# EAGLE design coffre2019 (EAGLE 8.5.2)
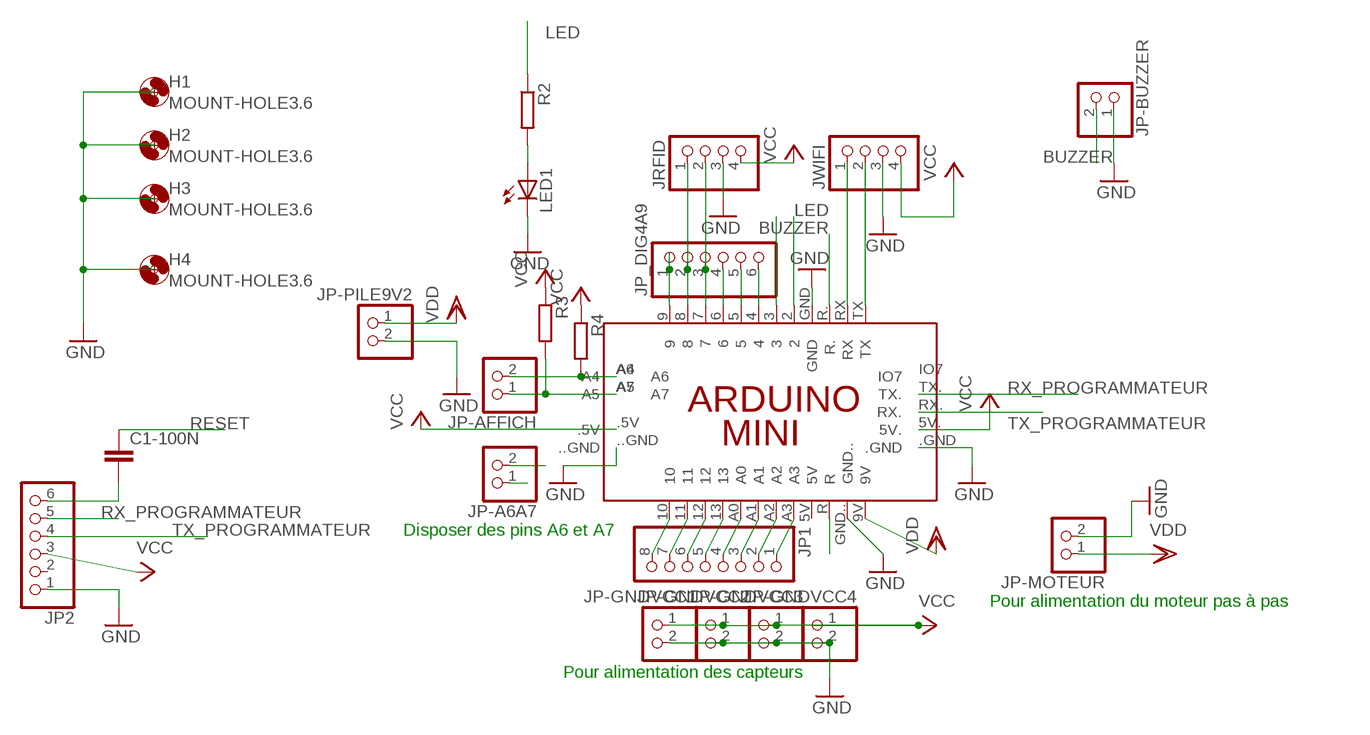
[diagram p0: schematic, sheet 1]

## Parts
C1-100N  C5/3  [C5B3]
H1  MOUNT-HOLE3.6  [3,6]
H2  MOUNT-HOLE3.6  [3,6]
H3  MOUNT-HOLE3.6  [3,6]
H4  MOUNT-HOLE3.6  [3,6]
JP1  PINHD-1X8  [1X08]
JP2  PINHD-1X6  [1X06]
JP-A6A7  PINHD-1X2  [1X02]
JP-AFFICH  PINHD-1X2  [1X02]
JP-BUZZER  PINHD-1X2  [1X02]
JP-GNDVCC1  PINHD-1X2  [1X02]
JP-GNDVCC2  PINHD-1X2  [1X02]
JP-GNDVCC3  PINHD-1X2  [1X02]
JP-GNDVCC4  PINHD-1X2  [1X02]
JP-MOTEUR  PINHD-1X2  [1X02]
JP-PILE9V2  PINHD-1X2  [1X02]
JP_DIG4A9  PINHD-1X6  [1X06]
JRFID  PINHD-1X4  [1X04]
JWIFI  PINHD-1X4  [1X04]
LED1  LED5MM  [LED5MM]
PCB1  ARDUINO_MINI  [ARDUINO_MINI]
R2  R-EU_0207/10  [0207/10]
R3  R-EU_0207/10  [0207/10]
R4  R-EU_0207/10  [0207/10]

## Nets
BUZZER: JP-BUZZER.2 PCB1.3
GND: JP2.1 JP-BUZZER.1 JP-GNDVCC1.2 JP-GNDVCC2.2 JP-GNDVCC3.2 JP-GNDVCC4.2 JP-MOTEUR.2 JP-PILE9V2.2 JRFID.3 JWIFI.3 LED1.K(C) PCB1...GND PCB1..GND PCB1.GND PCB1.GND..
LED: PCB1.2 R2.1
N$1: JP-MOTEUR.1
N$2: JP_DIG4A9.2 JRFID.1 PCB1.8
N$4: JWIFI.1 PCB1.RX
N$5: JP_DIG4A9.3 JRFID.2 PCB1.7
N$6: JWIFI.2 PCB1.TX
N$7: LED1.A R2.2
N$8: JP1.8 PCB1.10
N$9: JP1.7 PCB1.11
N$10: JP1.6 PCB1.12
N$11: JP1.5 PCB1.13
N$12: JP1.4 PCB1.A0
N$13: JP1.3 PCB1.A1
N$14: JP1.2 PCB1.A2
N$15: JP1.1 PCB1.A3
N$16: C1-100N.2 JP2.6
N$18: JP_DIG4A9.6 PCB1.4
N$19: JP_DIG4A9.5 PCB1.5
N$20: JP_DIG4A9.4 PCB1.6
N$21: JP-AFFICH.2 PCB1.A4 R4.2
N$22: JP-AFFICH.1 PCB1.A5 R3.2
N$23: PCB1.R
PIN9ARD: JP_DIG4A9.1 PCB1.9
RESET: C1-100N.1 PCB1.R.
RX_PROGRAMMATEUR: JP2.5 PCB1.TX.
TX_PROGRAMMATEUR: JP2.4 PCB1.RX.
VCC: JP2.3 JP-GNDVCC1.1 JP-GNDVCC2.1 JP-GNDVCC3.1 JP-GNDVCC4.1 JRFID.4 JWIFI.4 PCB1.5V. PCB1..5V R3.1 R4.1
VDD: JP-PILE9V2.1 PCB1.9V
VERSA6: JP-A6A7.2
VERSA7: JP-A6A7.1
Unconnected: JP2.2 PCB1.5V PCB1.A6 PCB1.A7 PCB1.IO7

## Notes on the sheet
- Disposer des pins A6 et A7
- Pour alimentation du moteur pas à pas
- Pour alimentation des capteurs

## Library data of the parts
C1-100N = capacitor-wima:C: CAPACITOR naming: grid - package width
H1-H4 = holes:MOUNT-HOLE: MOUNTING HOLE with drill center marker
JP1 = pinhead:PINHD-1X8: PIN HEADER
JP2 JP_DIG4A9 = pinhead:PINHD-1X6: PIN HEADER
JP-A6A7 JP-AFFICH JP-BUZZER JP-GNDVCC1-JP-GNDVCC4 JP-MOTEUR JP-PILE9V2 = pinhead:PINHD-1X2: PIN HEADER
JRFID JWIFI = pinhead:PINHD-1X4: PIN HEADER
LED1 = led:LED: LED OSRAM: - CHIPLED LG R971, LG N971, LY N971, LG Q971, LY Q971, LO R971, LY R971 LH N974, LH R974 LS Q976, LO Q976, LY Q976 LO Q996 - Hyper CHIPLED LW Q18S LB Q993, LB Q99A, LB R99A - SideLED LS A670, LO A670, LY A670, LG A670, LP A670 LB A673, LV A673, LT A673, LW A673 LH A674 LY A675 LS A676, LA A676, LO A676, LY A676, LW A676 LS A679, LY A679, LG A679 - Hyper Micro SIDELED® LS Y876, LA Y876, LO Y876, LY Y876 LT Y87S - SmartLED LW L88C, LW L88S LB L89C, LB L89S, LG L890 LS L89K, LO L89K, LY L89K LS L896, LA L896, LO L896, LY L896 - TOPLED LS T670, LO T670, LY T670, LG T670, LP T670 LSG T670, LSP T670, LSY T670, LOP T670, LYG T670 LG T671, LOG T671, LSG T671 LB T673, LV T673, LT T673, LW T673 LH T674 LS T676, LA T676, LO T676, LY T676, LB T676, LH T676, LSB T676, LW T676 LB T67C, LV T67C, LT T67C, LS T67K, LO T67K, LY T67K, LW E67C LS E67B, LA E67B, LO E67B, LY E67B, LB E67C, LV E67C, LT E67C LW T67C LS T679, LY T679, LG T679 LS T770, LO T770, LY T770, LG T770, LP T770 LB T773, LV T773, LT T773, LW T773 LH T774 LS E675, LA E675, LY E675, LS T675 LS T776, LA T776, LO T776, LY T776, LB T776 LHGB T686 LT T68C, LB T68C - Hyper Mini TOPLED® LB M676 - Mini TOPLED Santana® LG M470 LS M47K, LO M47K, LY M47K Source: http://www.osram.convergy.de LUXEON: - LUMILED® LXK2-PW12-R00, LXK2-PW12-S00, LXK2-PW14-U00, LXK2-PW14-V00 LXK2-PM12-R00, LXK2-PM12-S00, LXK2-PM14-U00 LXK2-PE12-Q00, LXK2-PE12-R00, LXK2-PE12-S00, LXK2-PE14-T00, LXK2-PE14-U00 LXK2-PB12-K00, LXK2-PB12-L00, LXK2-PB12-M00, LXK2-PB14-N00, LXK2-PB14-P00, LXK2-PB14-Q00 LXK2-PR12-L00, LXK2-PR12-M00, LXK2-PR14-Q00, LXK2-PR14-R00 LXK2-PD12-Q00, LXK2-PD12-R00, LXK2-PD12-S00 LXK2-PH12-R00, LXK2-PH12-S00 LXK2-PL12-P00, LXK2-PL12-Q00, LXK2-PL12-R00 Source: www.luxeon.com KINGBRIGHT: KA-3528ASYC Source: www.kingbright.com
PCB1 = E14_Arduino_revC:ARDUINO_MINI: Device for representing an Arduino Mini board with a footprint in an EAGLE design. Created by Dave Young for Element14. More EAGLE documentation at: http://www.element14.com/community/community/knode/cadsoft_eagle
R2-R4 = resistor:R-EU_: RESISTOR, European symbol

## Board
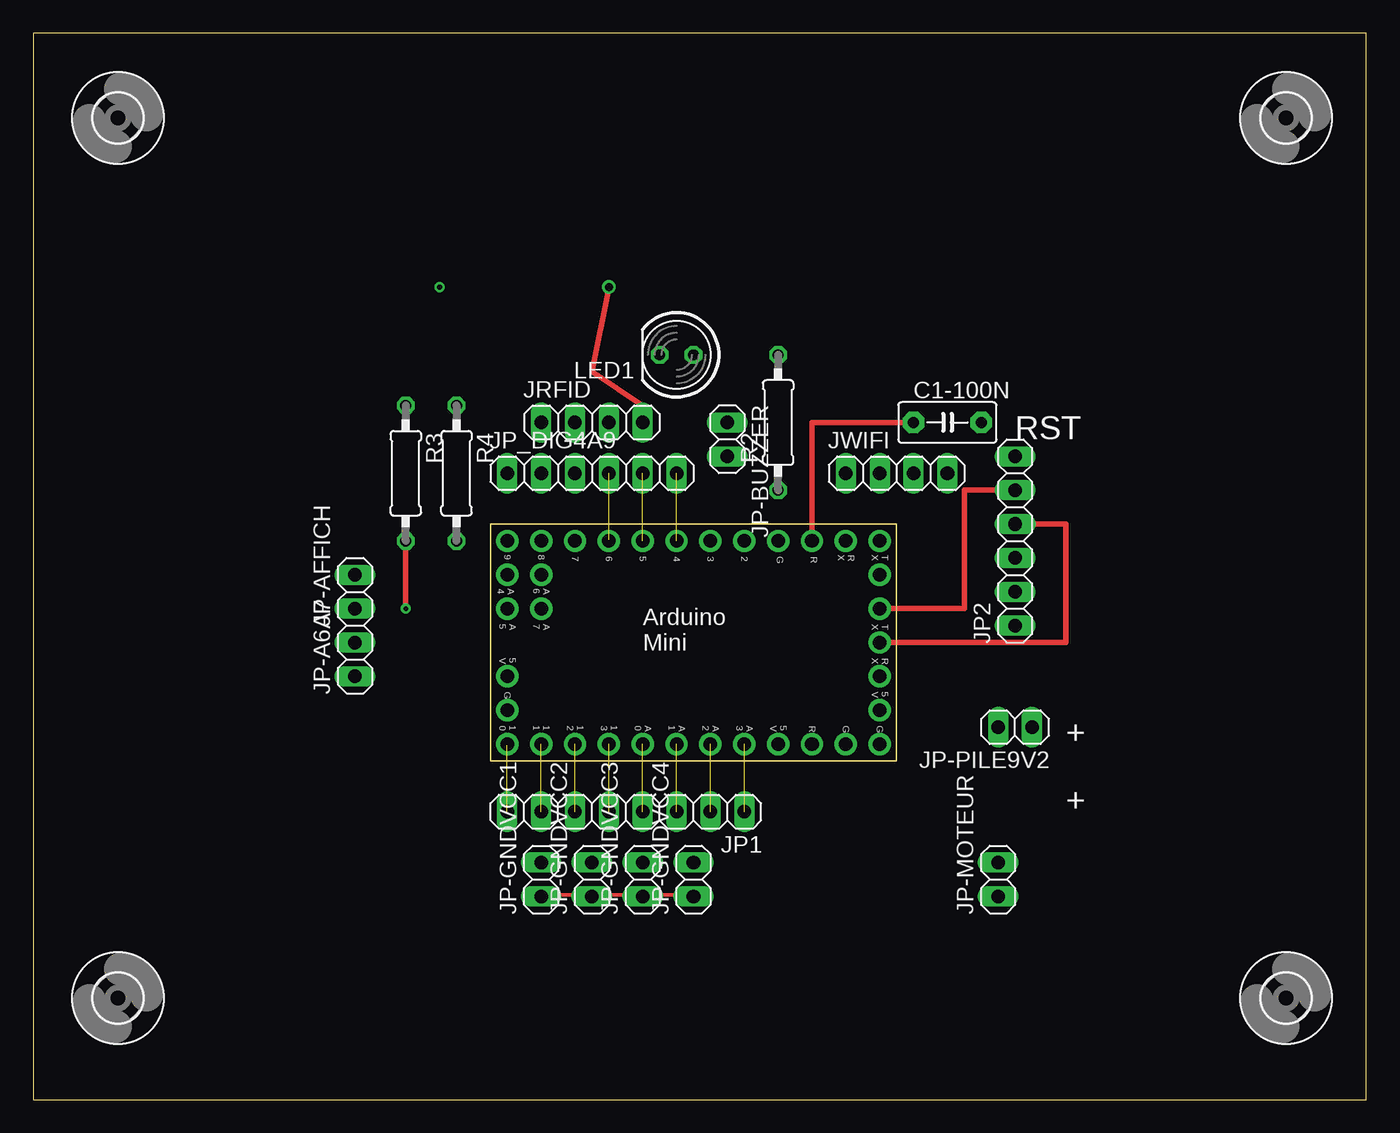
[diagram p1: board, top side]
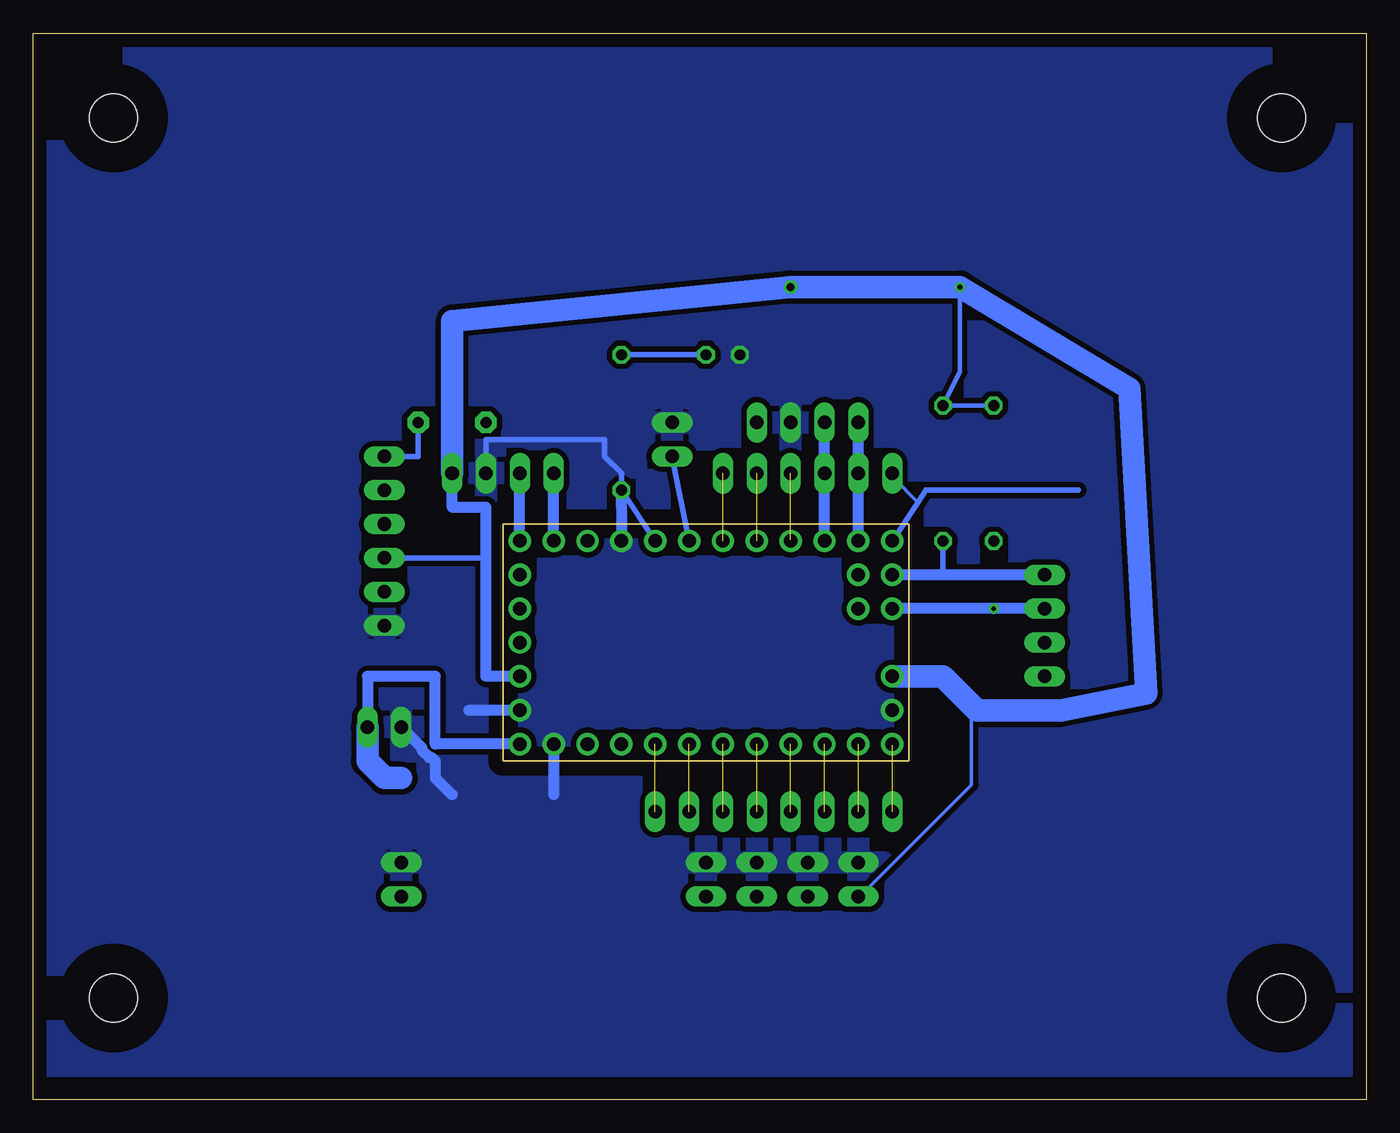
[diagram p2: board, bottom side, seen from below]

Size 100 x 80 mm. Coordinates in mm from the lower left corner, seen from the top.
Outline: 0,0 100,0 100,80 0,80 0,0
Copper layers (1*16): Top 0.035mm / dielectric 1.5mm / Bottom 0.035mm
Design rules "default *": minimum track width 10mil, minimum drill 24mil, track to track 16mil, track to pad 8mil, pad to pad 8mil, via to via 8mil, smd to smd 8mil, copper to edge 40mil, drill to drill 8mil, minimum pad ring 10mil, minimum via ring 8mil, stop-mask expansion 4mil, vias tented up to drill 0mil, thermal gap 10mil

### Footprints (pad centres in the part's own frame; a part is rotated, then mirrored left to right if it is on the bottom)
C5B3 = drill 0.813 pad 1.6 octagon: 1 -2.54,0; 2 2.54,0
3,6 = hole 3.6: 0,0
1X08 = drill 1.016 long: 1 -8.89,0; 2 -6.35,0; 3 -3.81,0; 4 -1.27,0; 5 1.27,0; 6 3.81,0; 7 6.35,0; 8 8.89,0
1X06 = drill 1.016 long: 1 -6.35,0; 2 -3.81,0; 3 -1.27,0; 4 1.27,0; 5 3.81,0; 6 6.35,0
1X02 = drill 1.016 long: 1 -1.27,0; 2 1.27,0
1X04 = drill 1.016 long: 1 -3.81,0; 2 -1.27,0; 3 1.27,0; 4 3.81,0
LED5MM = drill 0.813 octagon: A -1.27,0; K 1.27,0
ARDUINO_MINI = drill 1.016 pad 1.676: 2 19.05,16.51; 3 16.51,16.51; 4 13.97,16.51; 5 11.43,16.51; 5V 21.59,1.27; 5V. 29.21,6.35; 6 8.89,16.51; 7 6.35,16.51; 8 3.81,16.51; 9 1.27,16.51; 9V 29.21,1.27; 10 1.27,1.27; 11 3.81,1.27; 12 6.35,1.27; 13 8.89,1.27; .5V 1.27,6.35; ..GND 1.27,3.81; .GND 29.21,3.81; A0 11.43,1.27; A1 13.97,1.27; A2 16.51,1.27; A3 19.05,1.27; A4 1.27,13.97; A5 1.27,11.43; A6 3.81,13.97; A7 3.81,11.43; GND 21.59,16.51; GND.. 26.67,1.27; IO7 29.21,13.97; R 24.13,1.27; R. 24.13,16.51; RX 26.67,16.51; RX. 29.21,8.89; TX 29.21,16.51; TX. 29.21,11.43
0207/10 = drill 0.813 octagon: 1 -5.08,0; 2 5.08,0

### Placement (x,y rotation side)
C1-100N  68.58,50.8 0 top
H1  6.35,73.66 0 top
H2  93.98,73.66 0 top
H3  93.98,7.62 0 top
H4  6.35,7.62 0 top
JP1  44.45,21.59 180 top
JP2  73.66,41.91 90 top
JP-A6A7  24.13,33.02 90 top
JP-AFFICH  24.13,38.1 90 top
JP-BUZZER  52.07,49.53 270 top
JP-GNDVCC1  38.1,16.51 90 top
JP-GNDVCC2  41.91,16.51 90 top
JP-GNDVCC3  45.72,16.51 90 top
JP-GNDVCC4  49.53,16.51 90 top
JP-MOTEUR  72.39,16.51 90 top
JP-PILE9V2  73.66,27.94 180 top
JP_DIG4A9  41.91,46.99 0 top
JRFID  41.91,50.8 0 top
JWIFI  64.77,46.99 0 top
LED1  48.26,55.88 180 top
PCB1  34.29,25.4 0 top
R2  55.88,50.8 90 top
R3  27.94,46.99 270 top
R4  31.75,46.99 270 top

### Tracks (layer width: path | path; a pad name or v marks a point on that pad's centre or on a via)
BUZZER
  Bottom 0.406: JP-BUZZER.2 PCB1.3
GND
  Bottom 0.406: JWIFI.3 66.04,49.53 57.15,49.53 57.15,48.26 55.88,46.99 55.88,44.46
  Bottom 0.813: JP-PILE9V2.2 70.87,26.42 70.87,26.25 70.27,25.65 70.1,25.65 69.85,25.4 69.85,24.13 68.58,22.86 | PCB1.GND.. 60.96,22.86 | PCB1..GND 67.31,29.21 | PCB1.GND 55.88,44.46 55.88,45.72
  pour Bottom: 1.27,78.74 99.06,78.74 99.06,2.54 1.27,2.54
LED
  Bottom 0.406: PCB1.2 R2.1
N$2
  Bottom 0.254: JP_DIG4A9.2 38.2,47.07 38.1,47.07
  Bottom 0.813: PCB1.8 JP_DIG4A9.2 38.1,47.07 JRFID.1
N$4
  Bottom 0.813: PCB1.RX JWIFI.1
N$5
  Bottom 0.254: JP_DIG4A9.3 40.84,47.07 40.64,47.07
  Bottom 0.813: PCB1.7 JP_DIG4A9.3 40.64,47.07 JRFID.2
N$6
  Bottom 0.813: PCB1.TX JWIFI.2
N$7
  Bottom 0.406: R2.2 LED1.A
N$8  (1 unrouted)
  Bottom 0.152: PCB1.10 35.56,26.56
N$9  (1 unrouted)
N$10  (1 unrouted)
N$11  (1 unrouted)
N$12  (1 unrouted)
N$13  (1 unrouted)
N$14  (1 unrouted)
N$15  (1 unrouted)
N$16
  Bottom 0.406: JP2.6 71.12,48.26 C1-100N.2
N$18  (1 unrouted)
N$19  (1 unrouted)
N$20  (1 unrouted)
  Top 0.152: PCB1.6 43.18,42.02
N$21  (via drill 0.35)
  Bottom 0.254: 31.75,39.47 31.93,39.47 31.93,39.37
  Bottom 0.406: 31.75,39.37 31.75,39.47 R4.2
  Bottom 0.813: JP-AFFICH.2 31.93,39.37 PCB1.A4
  other vias: 35.56,39.37
N$22  (via drill 0.35)
  Top 0.152: PCB1.A5 35.67,36.83
  Top 0.406: R3.2 v27.94,36.83
  Bottom 0.813: JP-AFFICH.1 v27.94,36.83 PCB1.A5
PIN9ARD
  Bottom 0.254: JP_DIG4A9.1 35.56,46.74 33.58,44.75 33.64,44.79
  Bottom 0.406: PCB1.9 33.64,44.79 33.02,45.72 21.59,45.72
RESET
  Top 0.406: PCB1.R. 58.42,50.8 C1-100N.1
RX_PROGRAMMATEUR
  Top 0.406: PCB1.TX. 69.85,36.83 69.85,45.72 JP2.5
TX_PROGRAMMATEUR
  Top 0.406: PCB1.RX. 77.47,34.29 77.47,43.18 JP2.4
VCC  (via drill 0.35, 0.6)
  Top 0.254: JP-GNDVCC1.1 38.2,15.37 41.83,15.37 JP-GNDVCC2.1 42.16,15.37 45.47,15.37 JP-GNDVCC3.1 45.8,15.37 49.43,15.37 JP-GNDVCC4.1
  Top 0.406: v43.18,60.96 41.91,54.61 45.72,52.07 JRFID.4
  Bottom 0.254: 66.27,40.64 66.27,40.79 66.04,40.79 | 29.21,29.21 29.62,28.57 29.62,23.62 37.87,15.37 JP-GNDVCC1.1
  Bottom 0.32: R3.1 R4.1 30.48,54.61 v30.48,60.96
  Bottom 0.406: JP2.3 66.27,40.64 66.05,40.64
  Bottom 0.813: PCB1.5V. 66.04,31.75 66.04,40.79 66.04,44.45 68.58,44.45 JWIFI.4
  Bottom 1.676: PCB1..5V 31.75,31.75 29.21,29.21 22.86,29.21 16.51,30.48 17.78,53.34 v30.48,60.96 v43.18,60.96 68.58,58.42 JWIFI.4
  other vias: 31.75,52.07
VDD
  Bottom 0.813: PCB1.9V 69.85,26.67 69.85,31.75 74.93,31.75 JP-PILE9V2.1
  Bottom 1.676: 72.39,24.13 73.66,24.13 74.93,25.4 JP-PILE9V2.1

### Text on the board
_tsilk: RST | + | +